# Altium project alarm_clock_devkit.PrjPcb
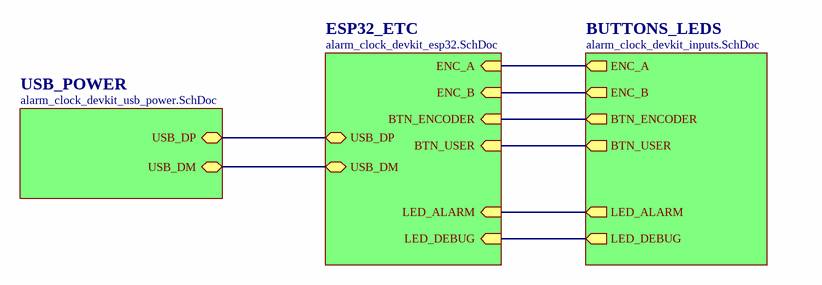
[diagram p0: alarm_clock_devkit_main.SchDoc]
4 sheets, 85 parts. Net scope: hierarchical (ports join the sheet entries above them; power ports are global).
Board file: alarm_clock_devkit.PcbDoc
Sheets:
  alarm_clock_devkit_main.SchDoc
    BUTTONS_LEDS = alarm_clock_devkit_inputs.SchDoc
    USB_POWER = alarm_clock_devkit_usb_power.SchDoc
    ESP32_ETC = alarm_clock_devkit_esp32.SchDoc

## Sheet alarm_clock_devkit_main.SchDoc: Wifi Alarm Clock
size 290 x 209 mm; Author: skilbeck.com; Revision: 1; SheetNumber: 1; SheetTotal: 1

### Sub-sheets
BUTTONS_LEDS = alarm_clock_devkit_inputs.SchDoc: BTN_USER (out), ENC_A (out), ENC_B (out), BTN_ENCODER (out), LED_DEBUG (out), LED_ALARM (out)
ESP32_ETC = alarm_clock_devkit_esp32.SchDoc: LED_DEBUG (in), BTN_ENCODER (in), BTN_USER (in), ENC_B (in), ENC_A (in), LED_ALARM (in), USB_DM (bidir), USB_DP (bidir)
USB_POWER = alarm_clock_devkit_usb_power.SchDoc: USB_DP (bidir), USB_DM (bidir)

### Nets
BTN_ENCODER: sheet BUTTONS_LEDS/BTN_ENCODER, sheet ESP32_ETC/BTN_ENCODER
BTN_USER: sheet BUTTONS_LEDS/BTN_USER, sheet ESP32_ETC/BTN_USER
ENC_A: sheet BUTTONS_LEDS/ENC_A, sheet ESP32_ETC/ENC_A
ENC_B: sheet BUTTONS_LEDS/ENC_B, sheet ESP32_ETC/ENC_B
LED_ALARM: sheet BUTTONS_LEDS/LED_ALARM, sheet ESP32_ETC/LED_ALARM
LED_DEBUG: sheet BUTTONS_LEDS/LED_DEBUG, sheet ESP32_ETC/LED_DEBUG
USB_DM: sheet USB_POWER/USB_DM, sheet ESP32_ETC/USB_DM
USB_DP: sheet USB_POWER/USB_DP, sheet ESP32_ETC/USB_DP

## Sheet alarm_clock_devkit_inputs.SchDoc
size 290 x 209 mm
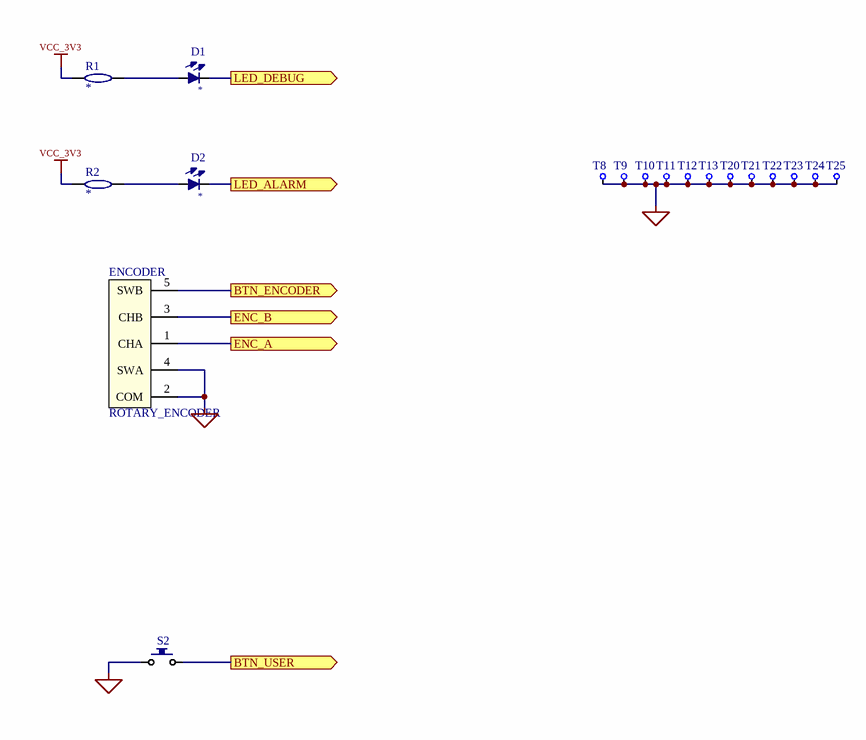
[diagram p1: alarm_clock_devkit_inputs.SchDoc]

### Parts
D1  *  [SMT_LED 0603_RED]
D2  *  [SMT_LED 0603_RED]
ENCODER  ROTARY_ENCODER  [ENCODER]
R1  *  [RES 0603_1608]
R2  *  [RES 0603_1608]
S2  4-1437565-1  [FSM-SWITCH]  (value not drawn)
T8  TESTPOINT  [TESTPOINT_TH]  (value not drawn)
T9  TESTPOINT  [TESTPOINT_TH]  (value not drawn)
T10  TESTPOINT  [TESTPOINT_TH]  (value not drawn)
T11  TESTPOINT  [TESTPOINT_TH]  (value not drawn)
T12  TESTPOINT  [TESTPOINT_TH]  (value not drawn)
T13  TESTPOINT  [TESTPOINT_TH]  (value not drawn)
T20  TESTPOINT  [TESTPOINT_TH]  (value not drawn)
T21  TESTPOINT  [TESTPOINT_TH]  (value not drawn)
T22  TESTPOINT  [TESTPOINT_TH]  (value not drawn)
T23  TESTPOINT  [TESTPOINT_TH]  (value not drawn)
T24  TESTPOINT  [TESTPOINT_TH]  (value not drawn)
T25  TESTPOINT  [TESTPOINT_TH]  (value not drawn)

### Ports
BTN_ENCODER (out), BTN_USER (out), ENC_A (out), ENC_B (out), LED_ALARM (out), LED_DEBUG (out)

### Nets
GND: ENCODER.2(COM) ENCODER.4(SWA) S2.1 T8.1 T9.1 T10.1 T11.1 T12.1 T13.1 T20.1 T21.1 T22.1 T23.1 T24.1 T25.1
VCC_3V3: R1.1(A) R2.1(A)
BTN_ENCODER: ENCODER.5(SWB) ; port BTN_ENCODER
BTN_USER: S2.2 ; port BTN_USER
ENC_A: ENCODER.1(CHA) ; port ENC_A
ENC_B: ENCODER.3(CHB) ; port ENC_B
LED_ALARM: D2.2(CATHODE) ; port LED_ALARM
LED_DEBUG: D1.2(CATHODE) ; port LED_DEBUG
NetD1_1: D1.1(ANODE) R1.2(B)
NetD2_1: D2.1(ANODE) R2.2(B)

### Library data of the parts
D1 D2 = LED: Value: *; LCSC Part Number: *
ENCODER = ROTARY_ENCODER: Rotary Encoder
R1 R2 = RESISTOR: Value: *; LCSC Part Number: *; Tolerance: *; Package: *; Power: *
S2 = BUTTON: 6x6mm tactile switch SPST_NO; Manufacturer_Name: TE Connectivity; Allied_Number: R1117787; RS Part Number: 1616046; Manufacturer_Part_Number: 4-1437565-1; Datasheet Link: http://uk.rs-online.com/web/p/products/1616046

## Sheet alarm_clock_devkit_usb_power.SchDoc
size 290 x 209 mm
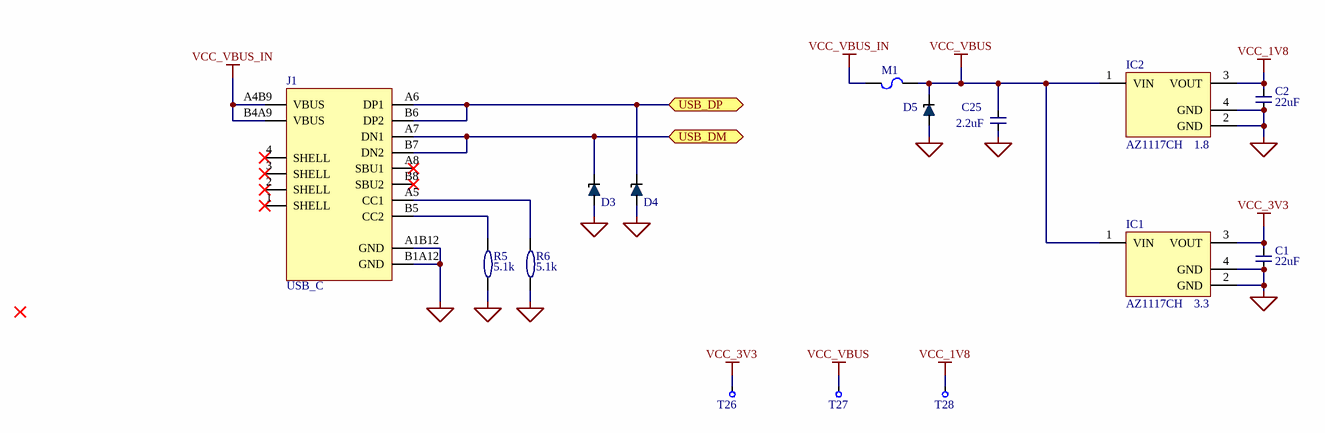
[diagram p2: alarm_clock_devkit_usb_power.SchDoc]

### Parts
C1  22uF  [CAP 0805_2012]
C2  22uF  [CAP 0805_2012]
C25  2.2uF  [CAP 0805_2012]
D3  TVS_DIODE  [SODFL98X40-2L]  (value not drawn)
D4  TVS_DIODE  [SODFL98X40-2L]  (value not drawn)
D5  TVS_DIODE  [SODFL98X40-2L]  (value not drawn)
IC1  AZ1117CH  VOUT: 3.3  [SOT230P700X180-4N]
IC2  AZ1117CH  VOUT: 1.8  [SOT230P700X180-4N]
J1  USB_C  [USB-C-SMD_G-SWITCH_GT-USB-7010ASV]
M1  FUSE  [FUSE 0603_1608 0.5MM]  (value not drawn)
R5  5.1k  [RES 0603_1608]
R6  5.1k  [RES 0603_1608]
T26  TESTPOINT  [TESTPOINT_1MM]  (value not drawn)
T27  TESTPOINT  [TESTPOINT_1MM]  (value not drawn)
T28  TESTPOINT  [TESTPOINT_1MM]  (value not drawn)

### Ports
USB_DM (bidir), USB_DP (bidir)

### Nets
GND: C1.1(A) C2.1(A) C25.1(A) D3.2(A) D4.2(A) D5.2(A) IC1.2(GND) IC1.4(GND) IC2.2(GND) IC2.4(GND) J1.A1B12(GND) J1.B1A12(GND) R5.1(A) R6.1(A)
VCC_1V8: C2.2(B) IC2.3(VOUT) T28.1
VCC_3V3: C1.2(B) IC1.3(VOUT) T26.1
VCC_VBUS: C25.2(B) D5.1(K) IC1.1(VIN) IC2.1(VIN) M1.2 T27.1
VCC_VBUS_IN: J1.A4B9(VBUS) J1.B4A9(VBUS) M1.1
USB_DM: D3.1(K) J1.A7(DN1) J1.B7(DN2) ; port USB_DM
USB_DP: D4.1(K) J1.A6(DP1) J1.B6(DP2) ; port USB_DP
NetJ1_A5: J1.A5(CC1) R6.2(B)
NetJ1_B5: J1.B5(CC2) R5.2(B)

Not connected (* = marked no-connect by the designer): J1 1(SHELL)* 2(SHELL)* 3(SHELL)* 4(SHELL)* A8(SBU1)* B8(SBU2)*

### Library data of the parts
C1 C2 C25 = CAP_CERAMIC: MLCC; LCSC Part Number: *; Tolerance: *; Voltage: *; Package: *; Dielectric: *
  C1 C2: Value: 22uF
  C25: Value: 2.2uF
R5 R6 = RESISTOR: Value: 5.1k; LCSC Part Number: *; Tolerance: *; Package: *; Power: *

## Sheet alarm_clock_devkit_esp32.SchDoc
size 290 x 209 mm
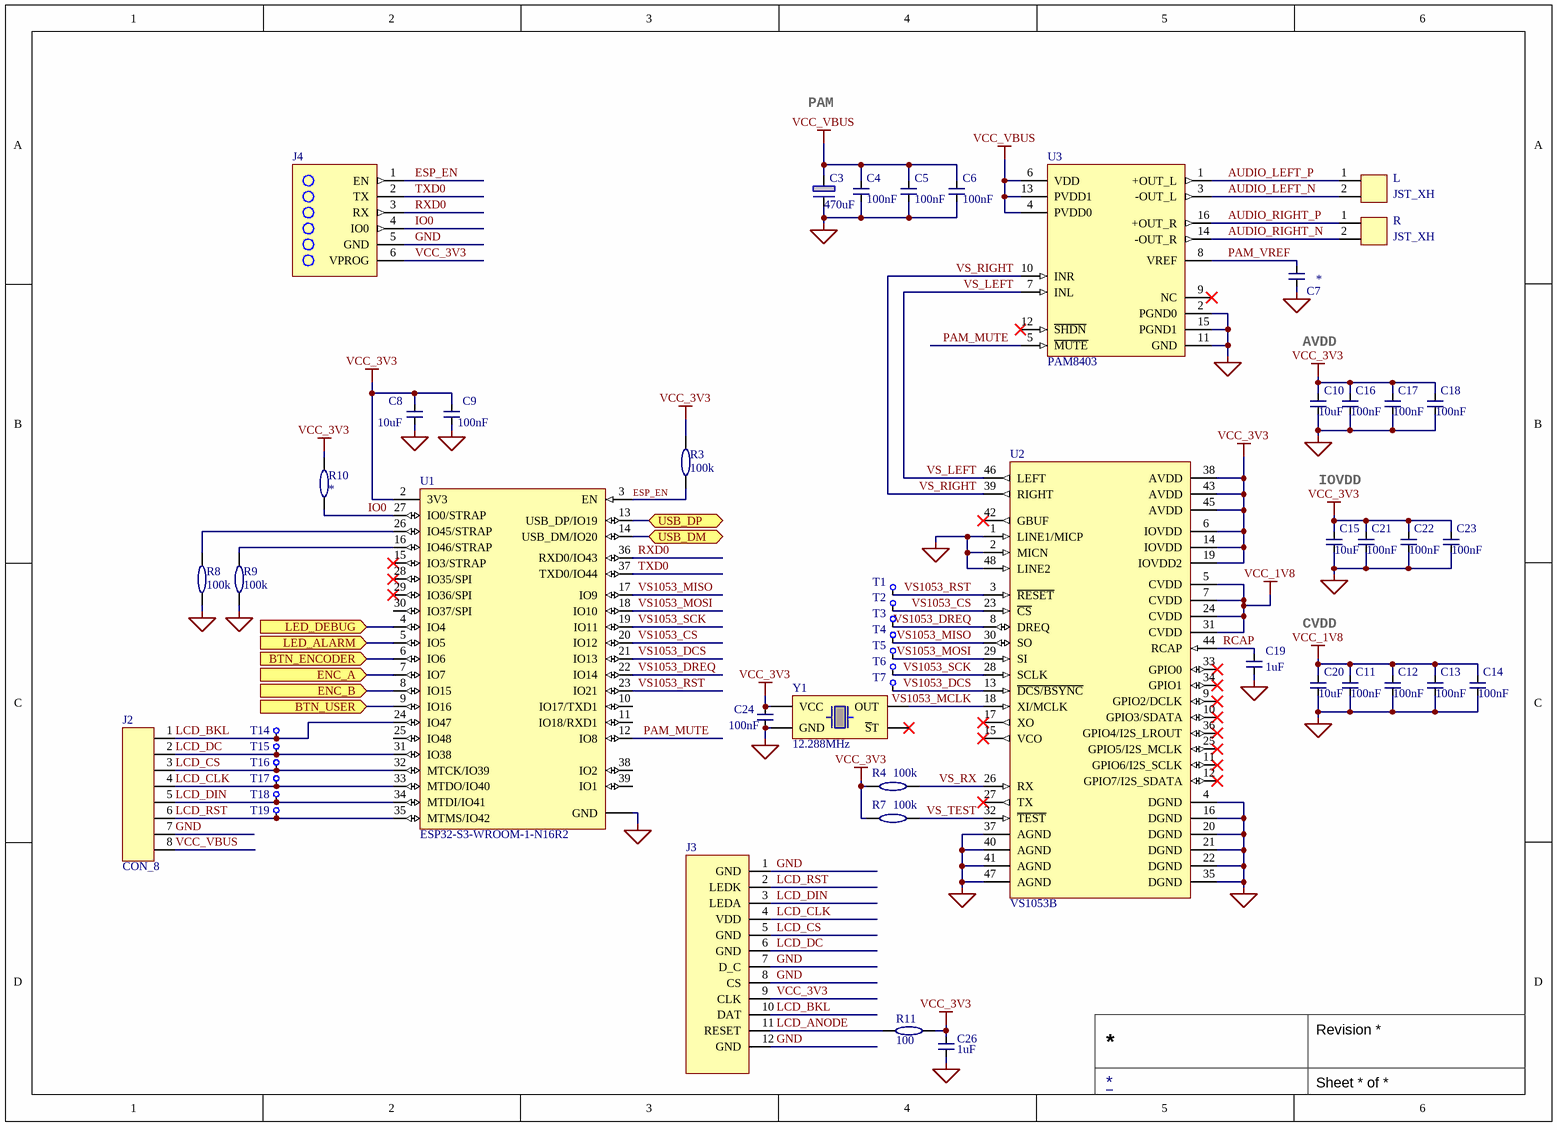
[diagram p3: alarm_clock_devkit_esp32.SchDoc]

### Parts
C3  470uF  [CAPMP7343X11L]
C4  100nF  [CAP 0603_1608]
C5  100nF  [CAP 0603_1608]
C6  100nF  [CAP 0603_1608]
C7  *  [CAP 0603_1608]
C8  10uF  [CAP 1210_3225]
C9  100nF  [CAP 0805_2012]
C10  10uF  [CAP 1210_3225]
C11  100nF  [CAP 0603_1608]
C12  100nF  [CAP 0603_1608]
C13  100nF  [CAP 0603_1608]
C14  100nF  [CAP 0603_1608]
C15  10uF  [CAP 1210_3225]
C16  100nF  [CAP 0603_1608]
C17  100nF  [CAP 0603_1608]
C18  100nF  [CAP 0603_1608]
C19  1uF  [CAP 0805_2012]
C20  10uF  [CAP 1210_3225]
C21  100nF  [CAP 0603_1608]
C22  100nF  [CAP 0603_1608]
C23  100nF  [CAP 0603_1608]
C24  100nF  [CAP 0603_1608]
C26  1uF  [CAP 0805_2012]
J2  CON_8  [CON8]
J3  LCD_CON12  [LCD_CON12]  (value not drawn)
J4  ESP_PROG  [ESP_PROG]  (value not drawn)  (no BOM)
L  JST_XH  [JST_XH_x2]
R  JST_XH  [JST_XH_x2]
R3  100k  [RES 0603_1608]
R4  100k  [RES 0603_1608]
R7  100k  [RES 0603_1608]
R8  100k  [RES 0603_1608]
R9  100k  [RES 0603_1608]
R10  *  [RES 0603_1608]
R11  100  [RES 0603_1608]
T1  TESTPOINT  [TESTPOINT_1MM]  (value not drawn)
T2  TESTPOINT  [TESTPOINT_1MM]  (value not drawn)
T3  TESTPOINT  [TESTPOINT_1MM]  (value not drawn)
T4  TESTPOINT  [TESTPOINT_1MM]  (value not drawn)
T5  TESTPOINT  [TESTPOINT_1MM]  (value not drawn)
T6  TESTPOINT  [TESTPOINT_1MM]  (value not drawn)
T7  TESTPOINT  [TESTPOINT_1MM]  (value not drawn)
T14  TESTPOINT  [TESTPOINT_1MM]  (value not drawn)
T15  TESTPOINT  [TESTPOINT_1MM]  (value not drawn)
T16  TESTPOINT  [TESTPOINT_1MM]  (value not drawn)
T17  TESTPOINT  [TESTPOINT_1MM]  (value not drawn)
T18  TESTPOINT  [TESTPOINT_1MM]  (value not drawn)
T19  TESTPOINT  [TESTPOINT_1MM]  (value not drawn)
U1  ESP32-S3-WROOM-1-N16R2  [XCVR_ESP32-S3-WROOM-1-N16R2]
U2  VS1053B  [CQFP50P900X900X140-48N]
U3  PAM8403  [SOIC127P600X175-16N]
Y1  12.288MHz  [NDK NX3225GA]

### Ports
BTN_ENCODER (in), BTN_USER (in), ENC_A (in), ENC_B (in), LED_ALARM (in), LED_DEBUG (in), USB_DM (bidir), USB_DP (bidir)

### Nets
GND: C3.2(-) C4.1(A) C5.1(A) C6.1(A) C7.1(A) C8.1(A) C9.1(A) C10.1(A) C11.1(A) C12.1(A) C13.1(A) C14.1(A) C15.1(A) C16.1(A) C17.1(A) C18.1(A) C19.1(A) C20.1(A) C21.1(A) C22.1(A) C23.1(A) C24.1(A) C26.1(A) J2.7 J3.1(GND) J3.7(D_C) J3.8(CS) J3.12(GND) J4.5(GND) R8.2(B) R9.1(A) U1.GND U2.1(LINE1/MICP) U2.2(MICN) U2.4(DGND) U2.16(DGND) U2.20(DGND) U2.21(DGND) U2.22(DGND) U2.35(DGND) U2.37(AGND) U2.40(AGND) U2.41(AGND) U2.47(AGND) U2.48(LINE2) U3.2(PGND0) U3.11(GND) U3.15(PGND1) Y1.2(GND)
VCC_1V8: C11.2(B) C12.2(B) C13.2(B) C14.2(B) C20.2(B) U2.5(CVDD) U2.7(CVDD) U2.24(CVDD) U2.31(CVDD)
VCC_3V3: C8.2(B) C9.2(B) C10.2(B) C15.2(B) C16.2(B) C17.2(B) C18.2(B) C21.2(B) C22.2(B) C23.2(B) C24.2(B) C26.2(B) J3.9(CLK) J4.6(VPROG) R3.2(B) R4.1(A) R7.1(A) R10.1(A) R11.2(B) U1.2(3V3) U2.6(IOVDD) U2.14(IOVDD) U2.19(IOVDD2) U2.38(AVDD) U2.43(AVDD) U2.45(AVDD) Y1.4(VCC)
VCC_VBUS: C3.1(+) C4.2(B) C5.2(B) C6.2(B) J2.8 U3.4(PVDD0) U3.6(VDD) U3.13(PVDD1)
AUDIO_LEFT_N: L.2 U3.3(-OUT_L)
AUDIO_LEFT_P: L.1 U3.1(+OUT_L)
AUDIO_RIGHT_N: R.2 U3.14(-OUT_R)
AUDIO_RIGHT_P: R.1 U3.16(+OUT_R)
BTN_ENCODER: U1.6(IO6) ; port BTN_ENCODER
BTN_USER: U1.9(IO16) ; port BTN_USER
ENC_A: U1.7(IO7) ; port ENC_A
ENC_B: U1.8(IO15) ; port ENC_B
ESP_EN: J4.1(EN) R3.1(A) U1.3(EN)
IO0: J4.4(IO0) R10.2(B) U1.27(IO0/STRAP)
LCD_ANODE: J3.11(RESET) R11.1(A)
LCD_BKL: J2.1 J3.10(DAT) T14.1 U1.24(IO47)
LCD_CLK: J2.4 J3.4(VDD) T17.1 U1.33(MTDO/IO40)
LCD_CS: J2.3 J3.5(GND) T16.1 U1.32(MTCK/IO39)
LCD_DC: J2.2 J3.6(GND) T15.1 U1.31(IO38)
LCD_DIN: J2.5 J3.3(LEDA) T18.1 U1.34(MTDI/IO41)
LCD_RST: J2.6 J3.2(LEDK) T19.1 U1.35(MTMS/IO42)
LED_ALARM: U1.5(IO5) ; port LED_ALARM
LED_DEBUG: U1.4(IO4) ; port LED_DEBUG
PAM_MUTE: U1.12(IO8) U3.5(~{MUTE})
PAM_VREF: C7.2(B) U3.8(VREF)
RCAP: C19.2(B) U2.44(RCAP)
RXD0: J4.3(RX) U1.36(RXD0/IO43)
TXD0: J4.2(TX) U1.37(TXD0/IO44)
USB_DM: U1.14(USB_DM/IO20) ; port USB_DM
USB_DP: U1.13(USB_DP/IO19) ; port USB_DP
VS1053_CS: T2.1 U1.20(IO12) U2.23(~{CS})
VS1053_DCS: T7.1 U1.21(IO13) U2.13(~{DCS/BSYNC})
VS1053_DREQ: T3.1 U1.22(IO14) U2.8(DREQ)
VS1053_MCLK: U2.18(XI/MCLK) Y1.3(OUT)
VS1053_MISO: T4.1 U1.17(IO9) U2.30(SO)
VS1053_MOSI: T5.1 U1.18(IO10) U2.29(SI)
VS1053_RST: T1.1 U1.23(IO21) U2.3(~{RESET})
VS1053_SCK: T6.1 U1.19(IO11) U2.28(SCLK)
VS_LEFT: U2.46(LEFT) U3.7(INL)
VS_RIGHT: U2.39(RIGHT) U3.10(INR)
VS_RX: R4.2(B) U2.26(RX)
VS_TEST: R7.2(B) U2.32(~{TEST})
NetR8_1: R8.1(A) U1.26(IO45/STRAP)
NetR9_2: R9.2(B) U1.16(IO46/STRAP)

Not connected (* = marked no-connect by the designer): U1 10(IO17/TXD1) 11(IO18/RXD1) 15(IO3/STRAP)* 25(IO48) 28(IO35/SPI)* 29(IO36/SPI)* 30(IO37/SPI) 38(IO2) 39(IO1); U2 9(GPIO2/DCLK)* 10(GPIO3/SDATA)* 11(GPIO6/I2S_SCLK)* 12(GPIO7/I2S_SDATA)* 15(VCO)* 17(XO)* 25(GPIO5/I2S_MCLK)* 27(TX)* 33(GPIO0)* 34(GPIO1)* 36(GPIO4/I2S_LROUT)* 42(GBUF)*; U3 9(NC)* 12(~{SHDN})*; Y1 1(~{S}T)*

### Notes on the sheet
- PAM
- AVDD
- IOVDD
- CVDD

### Library data of the parts
C3 = EEFCS1A470R: Electrolytic Capacitor; TYPE: Polymer; Voltage: 6.3V; Vendor: Panasonic; MPN: EEFCS1A470R; Value: 470uF
C4-C24 C26 = CAP_CERAMIC: MLCC; LCSC Part Number: *; Tolerance: *; Voltage: *; Package: *; Dielectric: *
  C4-C6 C9 C11-C14 C16-C18 C21-C24: Value: 100nF
  C7: Value: *
  C8 C10 C15 C20: Value: 10uF
  C19 C26: Value: 1uF
R3 R4 R7-R11 = RESISTOR: LCSC Part Number: *; Tolerance: *; Package: *; Power: *
  R3 R4 R7-R9: Value: 100k
  R10: Value: *
  R11: Value: 100
U1 = ESP32-S3-WROOM-1-N16R2: Bluetooth, WiFi 802.11b/g/n, Bluetooth v5.0 Transceiver Module 2.4GHz PCB Trace Surface Mount; MF: Espressif Systems; MP: ESP32S3WROOM1N16R2; SnapEDA_Link: https://www.snapeda.com/parts/ESP32S3WROOM1N16R2/Espressif+Systems/view-part/?ref=snap; Package: NON STANDARD Espressif Systems; Value: *; Check_prices: https://www.snapeda.com/parts/ESP32S3WROOM1N16R2/Espressif+Systems/view-part/?ref=eda; ClassName: ESP
U2 = VS1053B: VS1053B Music Maker Audio Feather Platform Evaluation Expansion Board; MF: SparkFun Electronics; MP: VS1053B; Price: None; SnapEDA_Link: https://www.snapeda.com/parts/VS1053B/SparkFun%20Electronics/view-part/525112/?ref=snap; Availability: Unavailable; Value: *; Package: None
U3 = PAM8403: Audio Amp Speaker 2-CH Stereo 3.2W Class-D 16-Pin SOP T/R; MF: Diodes Zetex; Check_prices: https://www.snapeda.com/parts/PAM8403/Zetex/view-part/?ref=eda; Package: None; MP: PAM8403; Value: *; Availability: In Stock; SnapEDA_Link: https://www.snapeda.com/parts/PAM8403/Zetex/view-part/?ref=snap; Price: None
Y1 = OSCILLATOR: SMT Crystal; Value: 12.288MHz

## Nets that join several sheets
GND: alarm_clock_devkit_inputs (15 pins), alarm_clock_devkit_usb_power (14 pins), alarm_clock_devkit_esp32 (49 pins)
VCC_1V8: alarm_clock_devkit_usb_power (C2.2 IC2.3 T28.1), alarm_clock_devkit_esp32 (9 pins)
VCC_3V3: alarm_clock_devkit_inputs (R1.1 R2.1), alarm_clock_devkit_usb_power (C1.2 IC1.3 T26.1), alarm_clock_devkit_esp32 (27 pins)
VCC_VBUS: alarm_clock_devkit_usb_power (6 pins), alarm_clock_devkit_esp32 (8 pins)
BTN_ENCODER: alarm_clock_devkit_inputs (ENCODER.5), alarm_clock_devkit_esp32 (U1.6)
BTN_USER: alarm_clock_devkit_inputs (S2.2), alarm_clock_devkit_esp32 (U1.9)
ENC_A: alarm_clock_devkit_inputs (ENCODER.1), alarm_clock_devkit_esp32 (U1.7)
ENC_B: alarm_clock_devkit_inputs (ENCODER.3), alarm_clock_devkit_esp32 (U1.8)
LED_ALARM: alarm_clock_devkit_inputs (D2.2), alarm_clock_devkit_esp32 (U1.5)
LED_DEBUG: alarm_clock_devkit_inputs (D1.2), alarm_clock_devkit_esp32 (U1.4)
USB_DM: alarm_clock_devkit_usb_power (D3.1 J1.A7 J1.B7), alarm_clock_devkit_esp32 (U1.14)
USB_DP: alarm_clock_devkit_usb_power (D4.1 J1.A6 J1.B6), alarm_clock_devkit_esp32 (U1.13)